# Altium schematic sheet powerModel.SchDoc: 电源模块
size A4; Author: 潘全星; DocumentNumber: 01
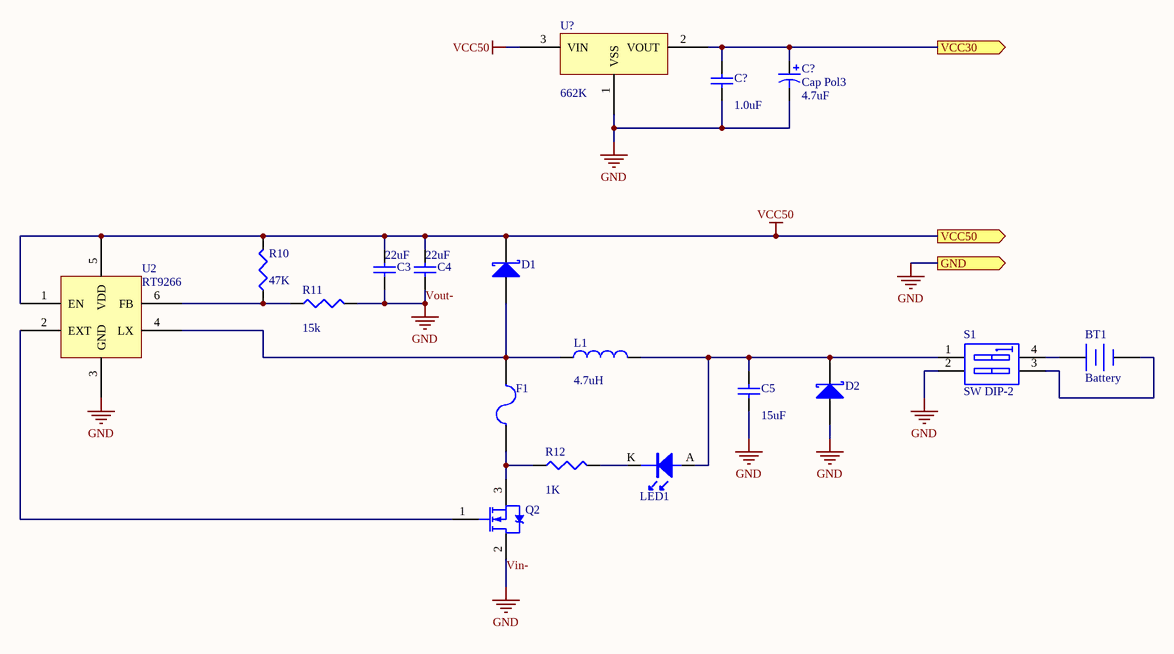
[diagram p0: powerModel.SchDoc]

## Parts
(Parts that share a designator on the sheet are numbered #1, #2 ... from top to bottom, then left to right.)
BT1  Battery  [BAT-2]
C3  value 22uF  [C1210]
C4  value 22uF  [C1210]
C5  value 15uF  [cap-0805]
C?#1  Cap Pol3  value 4.7uF  [C0805]
C?#2  value 1.0uF  [cap-0805]
D1  (no value)  [SMB]
D2  (no value)  [SMB]
F1  (no value)  [RES-0603 - 1]
L1  value 4.7uH  [INDUCE2]
LED1  LED  [DIO-0805]  (value not drawn)
Q2  (no value)  [SOT23-3_L]
R10  value 47K  [RES-1206]
R11  value 15k  [RES-1206]
R12  value 1K  [RES-1206]
S1  SW DIP-2  [DIP_SW_2WAY_SMD02]
U2  RT9266  [SOT23-6_M]
U?  662K  [SOT23-3_L]

## Ports
GND (out), VCC30 (out), VCC50 (out)

## Nets
VCC50: C3.2 C4.2 D1.2(K) R10.2 U2.1(EN) U2.5(VDD) U?.3(VIN) ; port VCC50
Vin-: C3.1 C4.1 C5.1 C?#1.2 C?#2.1 D2.1(A) Q2.2(D) R11.2 S1.2(A2) U2.3(GND) U?.1(VSS) ; port GND  [also labelled GND, Vout-]
VCC30: C?#1.1 C?#2.2 U?.2(VOUT) ; port VCC30
NetBT1_1: BT1.1(+) S1.4(B1)
NetBT1_2: BT1.2(-) S1.3(B2)
NetC5_2: C5.2 D2.2(K) L1.2 LED1.A S1.1(A1)
NetD1_1: D1.1(A) F1.2 L1.1 U2.4(LX)
NetF1_1: F1.1 Q2.3(S) R12.1
NetLED1_K: LED1.K R12.2
NetQ2_1: Q2.1(G) U2.2(EXT)
NetR10_1: R10.1 R11.1 U2.6(FB)

## Notes on the sheet
- Title
- Size:
- Date:
- A4
- Number:
- Time:
- Revision:
- Sheet
- of
- File:

## Library data of the parts
BT1 = Battery: Multicell Battery; Published: 24-Mar-1999; LatestRevisionDate: 17-Jul-2002; LatestRevisionNote: Re-released for DXP Platform.; PackageReference: BAT-2; Publisher: Altium Limited; PackageDescription: Battery; 2 Leads
C3-C5 = Cap Semi: Capacitor (Semiconductor SIM Model); Published: 8-Jun-2000; LatestRevisionDate: 29-May-2009; LatestRevisionNote: IPC-7351 Footprint Added.; PackageReference: C1206; Publisher: Altium Limited; PackageDescription: Chip Capacitor
C?#1 = Cap Pol3: Polarized Capacitor (Surface Mount); Published: 8-Jun-2000; LatestRevisionDate: 29-May-2009; LatestRevisionNote: IPC-7351 Footprint Added.; PackageReference: C0805; Publisher: Altium Limited; PackageDescription: Chip Capacitor
C?#2 = Cap: Capacitor; Published: 8-Jun-2000; LatestRevisionDate: 17-Jul-2002; LatestRevisionNote: Re-released for DXP Platform.; PackageReference: RAD-0.3; Publisher: Altium Limited; PackageDescription: Radial Cap, Thru-Hole; 2 Leads; 0.3 in Pin Spacing
D1 D2 = D Schottky: Schottky Diode; Published: 8-Jun-2000; LatestRevisionDate: 17-Jul-2002; LatestRevisionNote: Re-released for DXP Platform.; PackageReference: SMB; Publisher: Altium Limited; PackageDescription: DO-214-AA/SMB; 2 C-Bend Leads; Body 5.3 x 3.6 mm, inc. leads (LxW); Code_JEDEC: DO-214-AA
F1 = Fuse 2: Fuse; Published: 8-Jun-2000; LatestRevisionDate: 17-Jul-2002; LatestRevisionNote: Re-released for DXP Platform.; PackageReference: PIN-W2/E2.8; Publisher: Altium Limited; PackageDescription: Thru-Hole; 2 Leads
L1 = Inductor: Code_IEC: 1005; Published: 8-Jun-2000; LatestRevisionDate: 29-May-2009; LatestRevisionNote: IPC-7351 Footprint Added.; PackageReference: 0402-A; Publisher: Altium Limited; PackageDescription: Chip Inductor; Code_JEITA: 0402
LED1 = LED_1: 发光二级管
Q2 = NMOS-2: N-Channel Power MOSFET; Note: Pin 2 is electrically connected to pin 4.; Published: 8-Jun-2000; LatestRevisionDate: 17-Jul-2002; LatestRevisionNote: Re-released for DXP Platform.; DatasheetVersion: PD-9.814; PackageVersion: Feb-1997; PackageReference: TO-220AB; Publisher: Altium Limited; PackageDescription: TO, Thru-Hole, Vertical, Heatsink Mounted; 3 In-Line Leads; Pitch 2.54 mm; ComponentLink1Description: Manufacturer Link; ComponentLink1URL: http://www.irf.com/
R10-R12 = Res3: Resistor; Published: 8-Jun-2000; LatestRevisionDate: 29-May-2009; LatestRevisionNote: IPC-7351 Footprint Added.; PackageReference: J1-0603; Publisher: Altium Limited; PackageDescription: Chip Resistor
S1 = SW DIP-2: DIP Switch, 2 Position, SPST; Published: 24-Mar-1999; LatestRevisionDate: 17-Jul-2002; LatestRevisionNote: Re-released for DXP Platform.; PackageReference: DIP-4; Publisher: Altium Limited
U2 = RT9266(31-32N)